# Altium schematic sheet IO模組燈.SchDoc
size A3
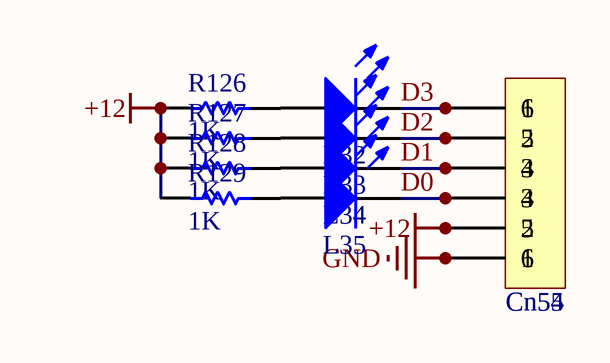
[diagram p0: IO模組燈.SchDoc]

## Parts
Cn54  KF2510-6  [Connector_KF2510-6A]  (value not drawn)
Cn55  KF2510-6  [Connector_KF2510-6A]  (value not drawn)
L32  藍  [LED-1206]  (value not drawn)
L33  藍  [LED-1206]  (value not drawn)
L34  藍  [LED-1206]  (value not drawn)
L35  藍  [LED-1206]  (value not drawn)
R126  1K  [Res-1206]
R127  1K  [Res-1206]
R128  1K  [Res-1206]
R129  1K  [Res-1206]

## Nets
+12: Cn54.5 Cn55.2 R126.2 R127.2 R128.2 R129.2
GND: Cn54.6 Cn55.1
D0: Cn54.4 Cn55.3 L35.1(K)
D1: Cn54.3 Cn55.4 L34.1(K)
D2: Cn54.2 Cn55.5 L33.1(K)
D3: Cn54.1 Cn55.6 L32.1(K)
NetL32_2: L32.2(A) R126.1
NetL33_2: L33.2(A) R127.1
NetL34_2: L34.2(A) R128.1
NetL35_2: L35.2(A) R129.1

## Library data of the parts
Cn54 Cn55 = Contact(6P): 接線端子
L32-L35 = LED
R126-R129 = Res: 電阻